# Altium schematic sheet 01_Cover page.SchDoc
size A3; SheetNumber: 1; SheetTotal: 4
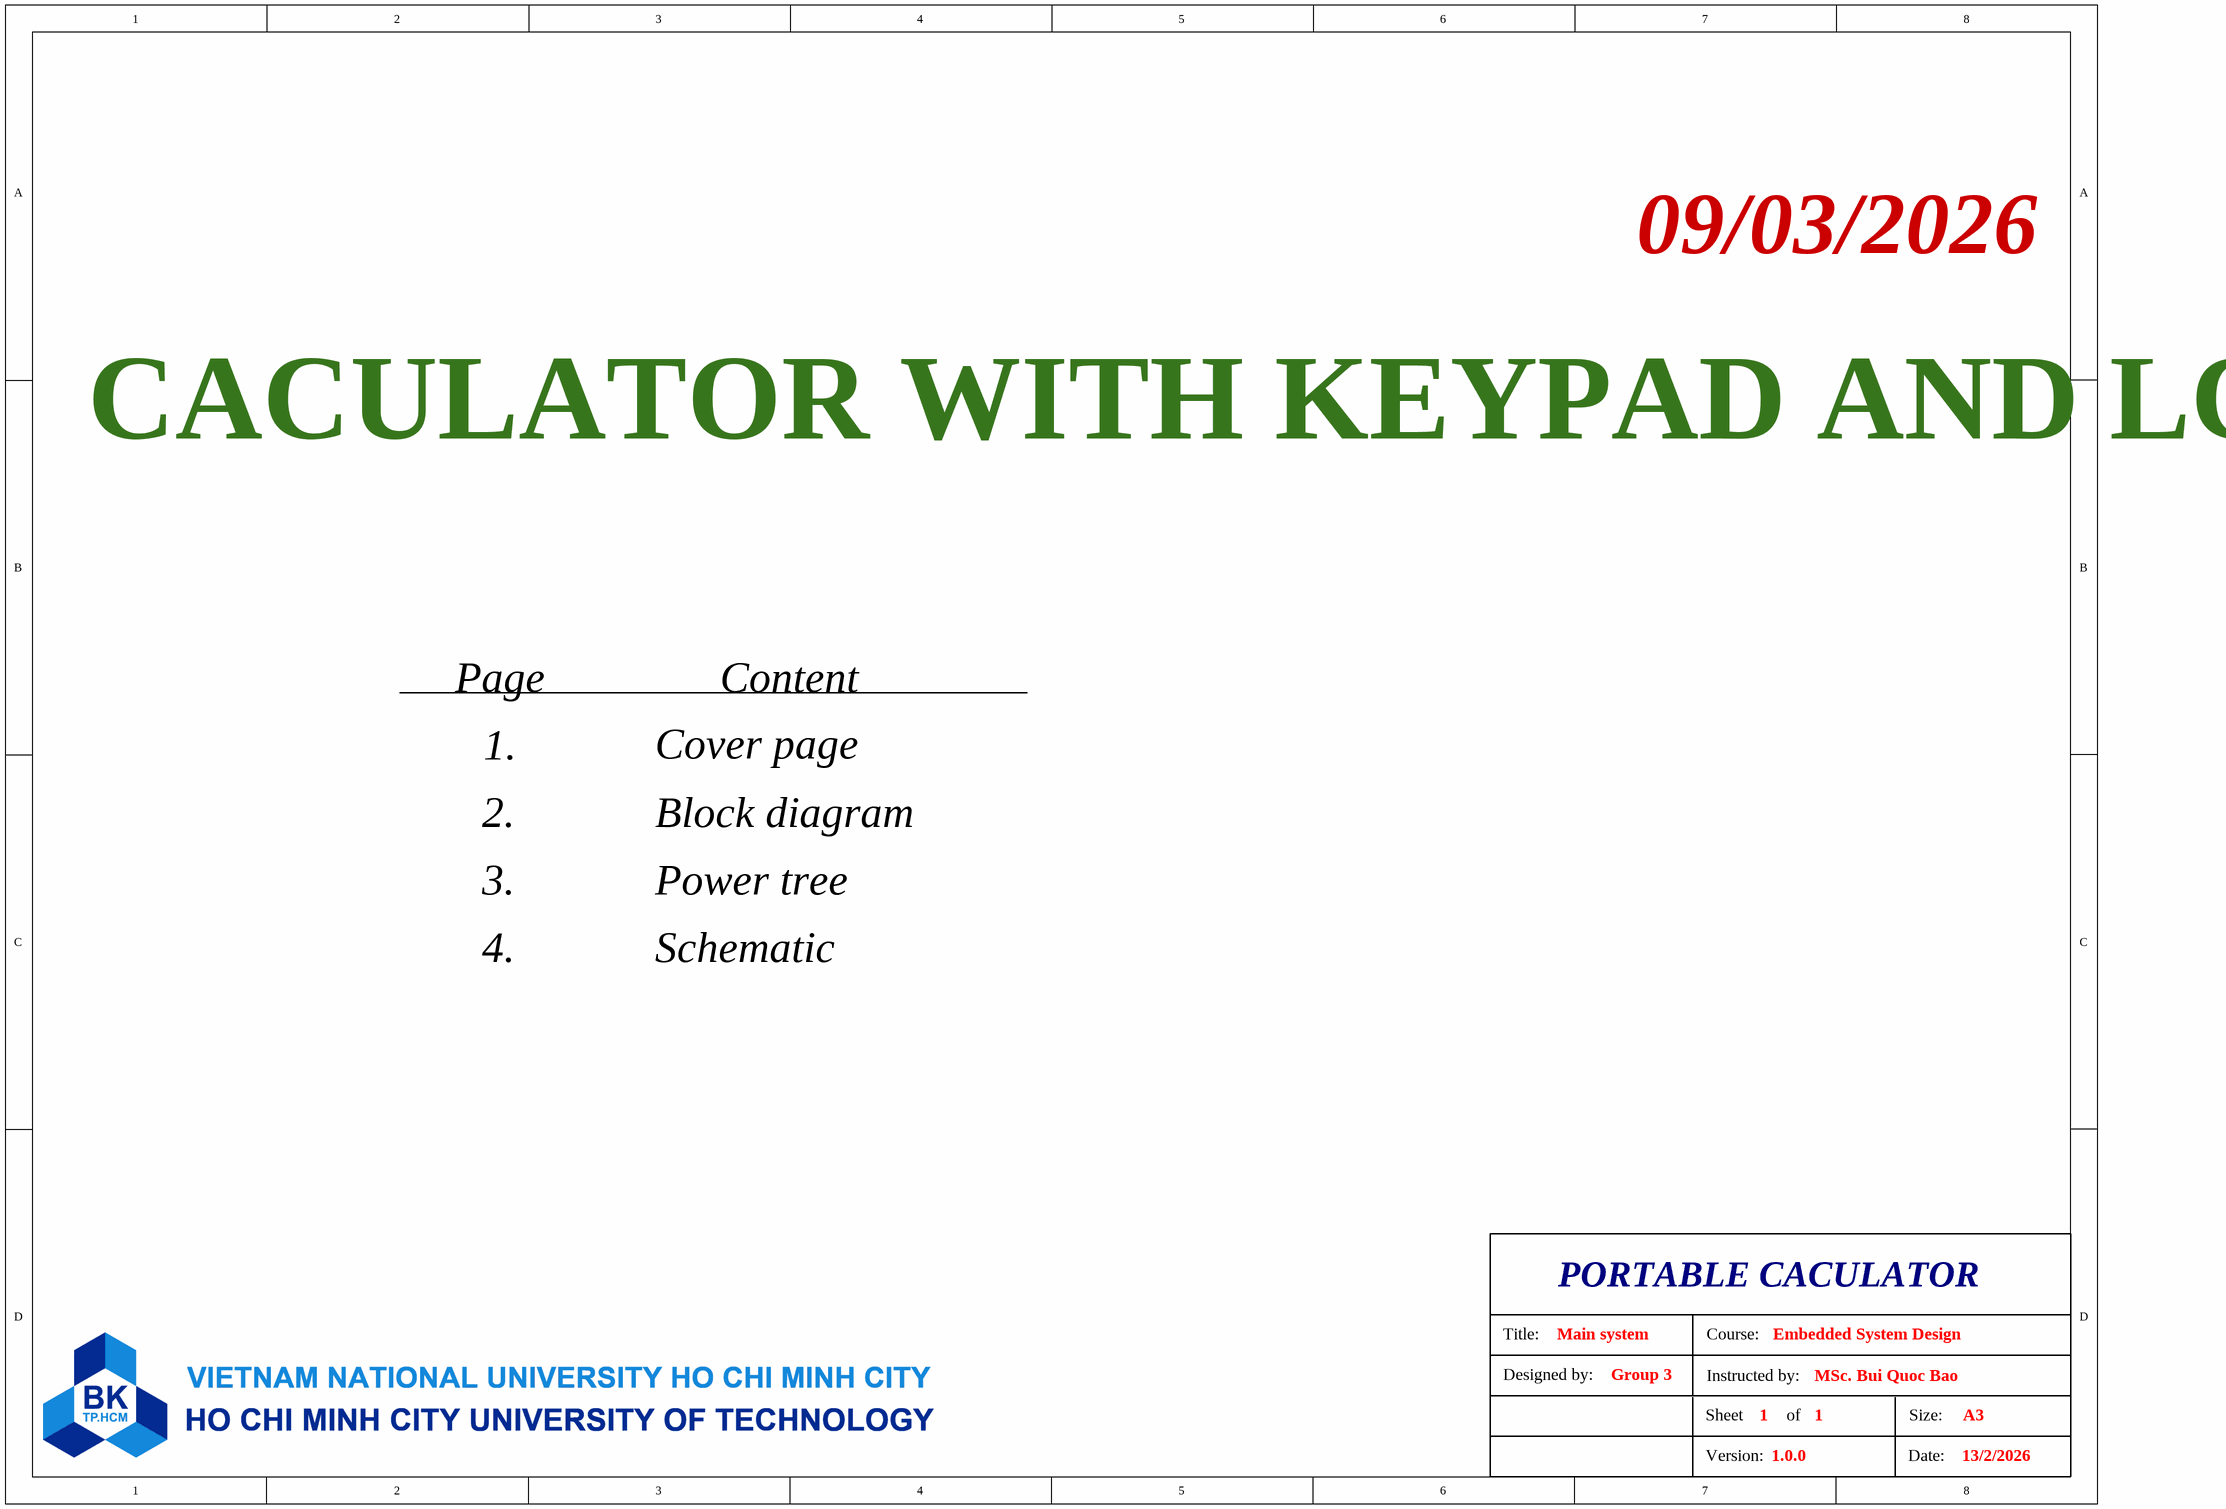
[diagram p0: 01_Cover page.SchDoc]

## Notes on the sheet
- 09/03/2026
- CACULATOR WITH KEYPAD AND LCD
- Page
- Content
- 1.
- Cover page
- 2.
- Block diagram
- 3.
- Power tree
- 4.
- Schematic
- PORTABLE CACULATOR
- Designed by:
- Title:
- Main system
- Group 3
- Instructed by:
- Course:
- Embedded System Design
- MSc. Bui Quoc Bao
- Version:
- Sheet
- 1
- 1.0.0
- of
- Date:
- Size:
- 13/2/2026
- A3